# EAGLE design Versino1 (EAGLE 9.6.2)

## Sheet 1 of 2
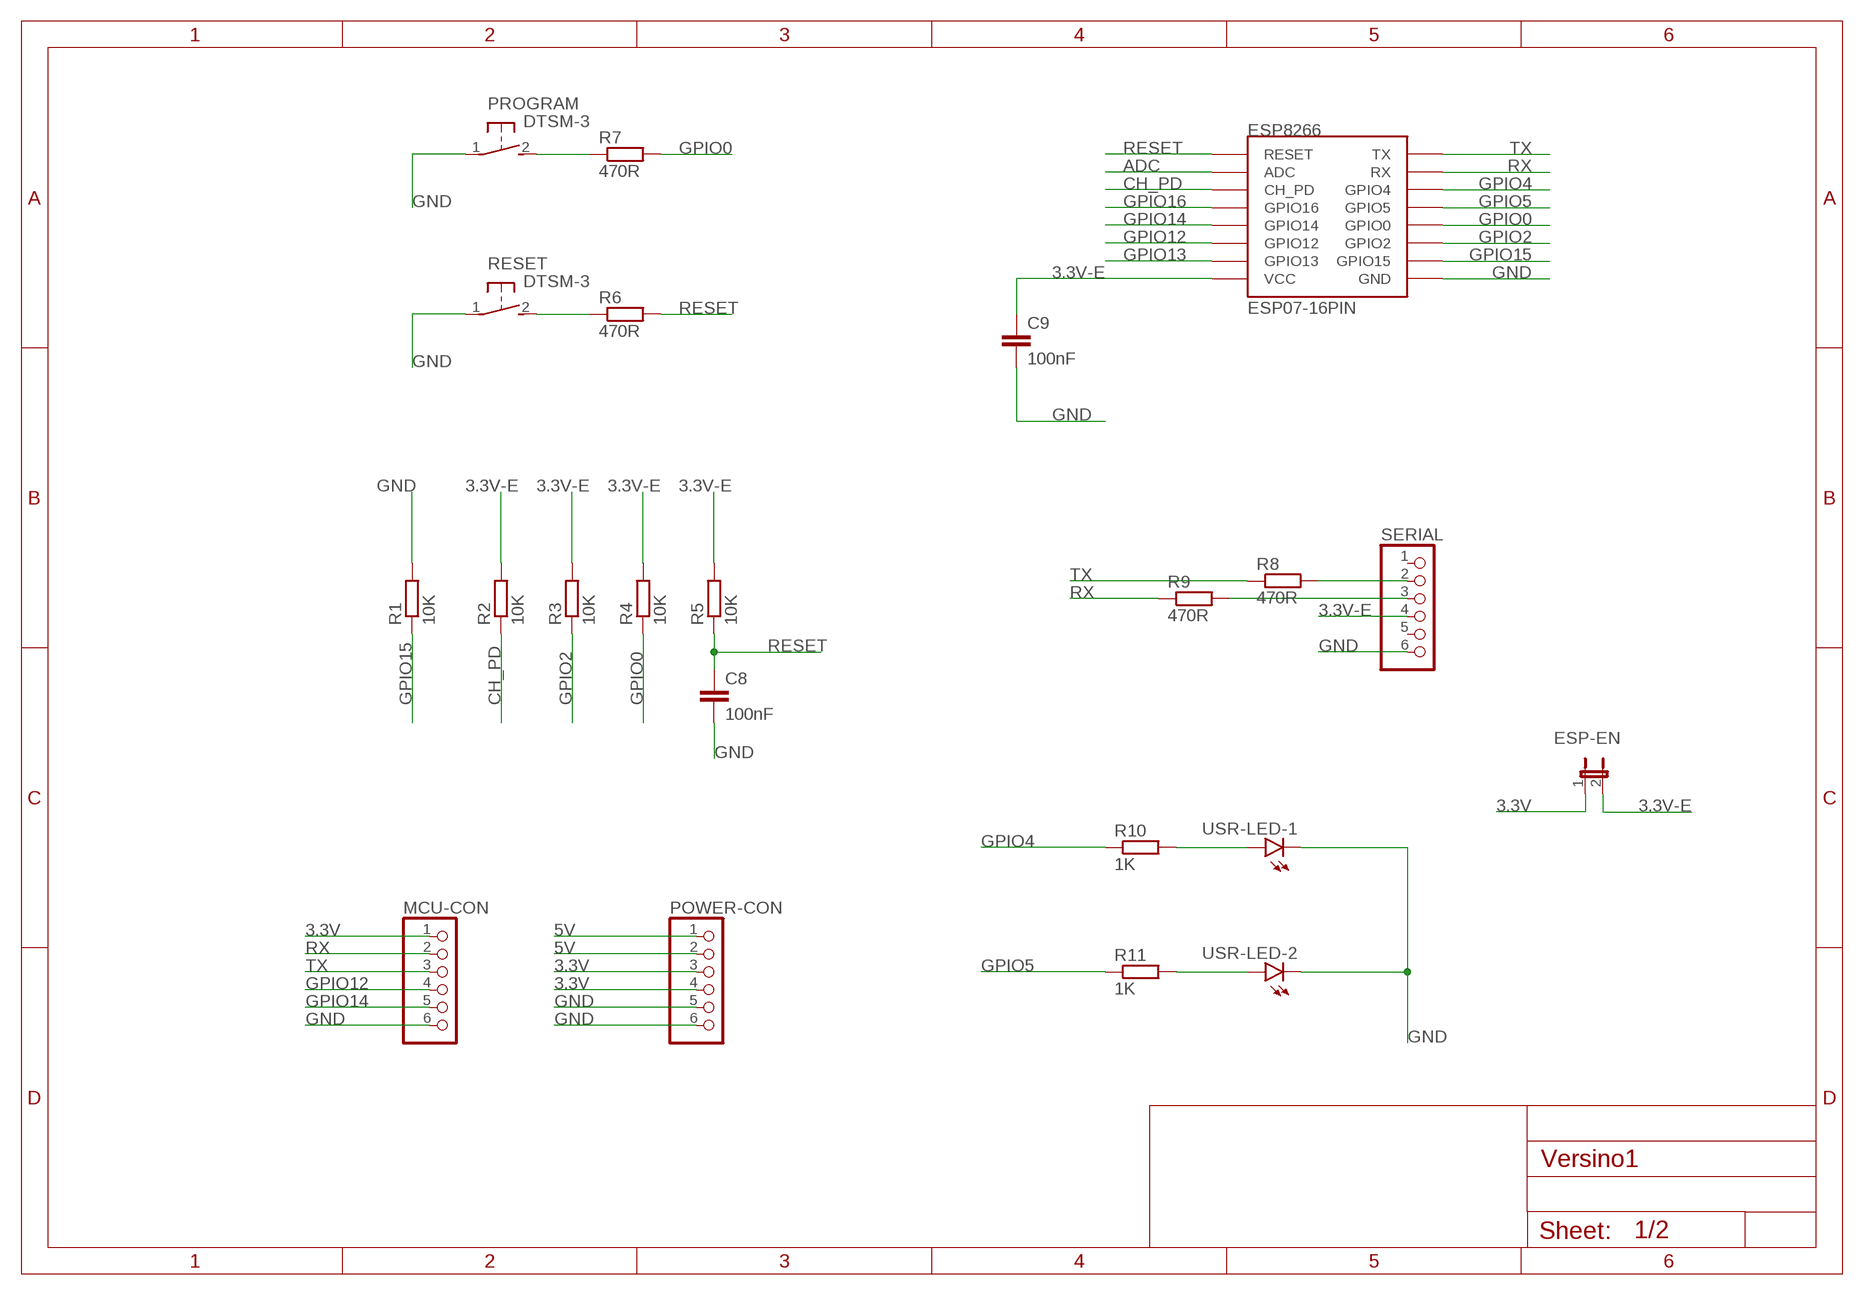
[diagram p0: schematic, sheet 1]

### Parts
C8  100nF  C-EUC0603  [C0603]
C9  100nF  C-EUC0603  [C0603]
ESP8266  ESP07-16PIN  [ESP07-16PIN]
ESP-EN  JP1E  [JP1]
MCU-CON  PINHD-1X6  [1X06]
POWER-CON  PINHD-1X6  [1X06]
PROGRAM  DTSM-3  [DTSM-3]
R1  10K  R-EU_R0603  [R0603]
R2  10K  R-EU_R0603  [R0603]
R3  10K  R-EU_R0603  [R0603]
R4  10K  R-EU_R0603  [R0603]
R5  10K  R-EU_R0603  [R0603]
R6  470R  R-EU_R0603  [R0603]
R7  470R  R-EU_R0603  [R0603]
R8  470R  R-EU_R0603  [R0603]
R9  470R  R-EU_R0603  [R0603]
R10  1K  R-EU_R0603  [R0603]
R11  1K  R-EU_R0603  [R0603]
RESET  DTSM-3  [DTSM-3]
SERIAL  PINHD-1X6  [1X06]
USR-LED-1  LEDCHIP-LED0805  [CHIP-LED0805]
USR-LED-2  LEDCHIP-LED0805  [CHIP-LED0805]

### Nets
3.3V: ESP-EN.1 MCU-CON.1 POWER-CON.3 POWER-CON.4 ; also sheet 2
3.3V-E: C9.1 ESP8266.VCC ESP-EN.2 R2.2 R3.2 R4.2 R5.2 SERIAL.4
5V: POWER-CON.1 POWER-CON.2 ; also sheet 2
ADC: ESP8266.ADC
CH_PD: ESP8266.CH_PD R2.1
GND: C8.2 C9.2 ESP8266.GND MCU-CON.6 POWER-CON.5 POWER-CON.6 PROGRAM.1 R1.2 RESET.1 SERIAL.6 USR-LED-1.C USR-LED-2.C ; also sheet 2
GPIO0: ESP8266.GPIO0 R4.1 R7.2
GPIO2: ESP8266.GPIO2 R3.1
GPIO4: ESP8266.GPIO4 R10.1
GPIO5: ESP8266.GPIO5 R11.1
GPIO12: ESP8266.GPIO12 MCU-CON.4
GPIO13: ESP8266.GPIO13
GPIO14: ESP8266.GPIO14 MCU-CON.5
GPIO15: ESP8266.GPIO15 R1.1
GPIO16: ESP8266.GPIO16
N$1: PROGRAM.2 R7.1
N$2: R6.1 RESET.2
N$3: R8.2 SERIAL.2
N$4: R9.2 SERIAL.3
N$28: R11.2 USR-LED-2.A
N$29: R10.2 USR-LED-1.A
RESET: C8.1 ESP8266.REST(RESET) R5.1 R6.2
RX: ESP8266.RX MCU-CON.2 R9.1
TX: ESP8266.TX MCU-CON.3 R8.1
Unconnected: SERIAL.1 SERIAL.5

## Sheet 2 of 2
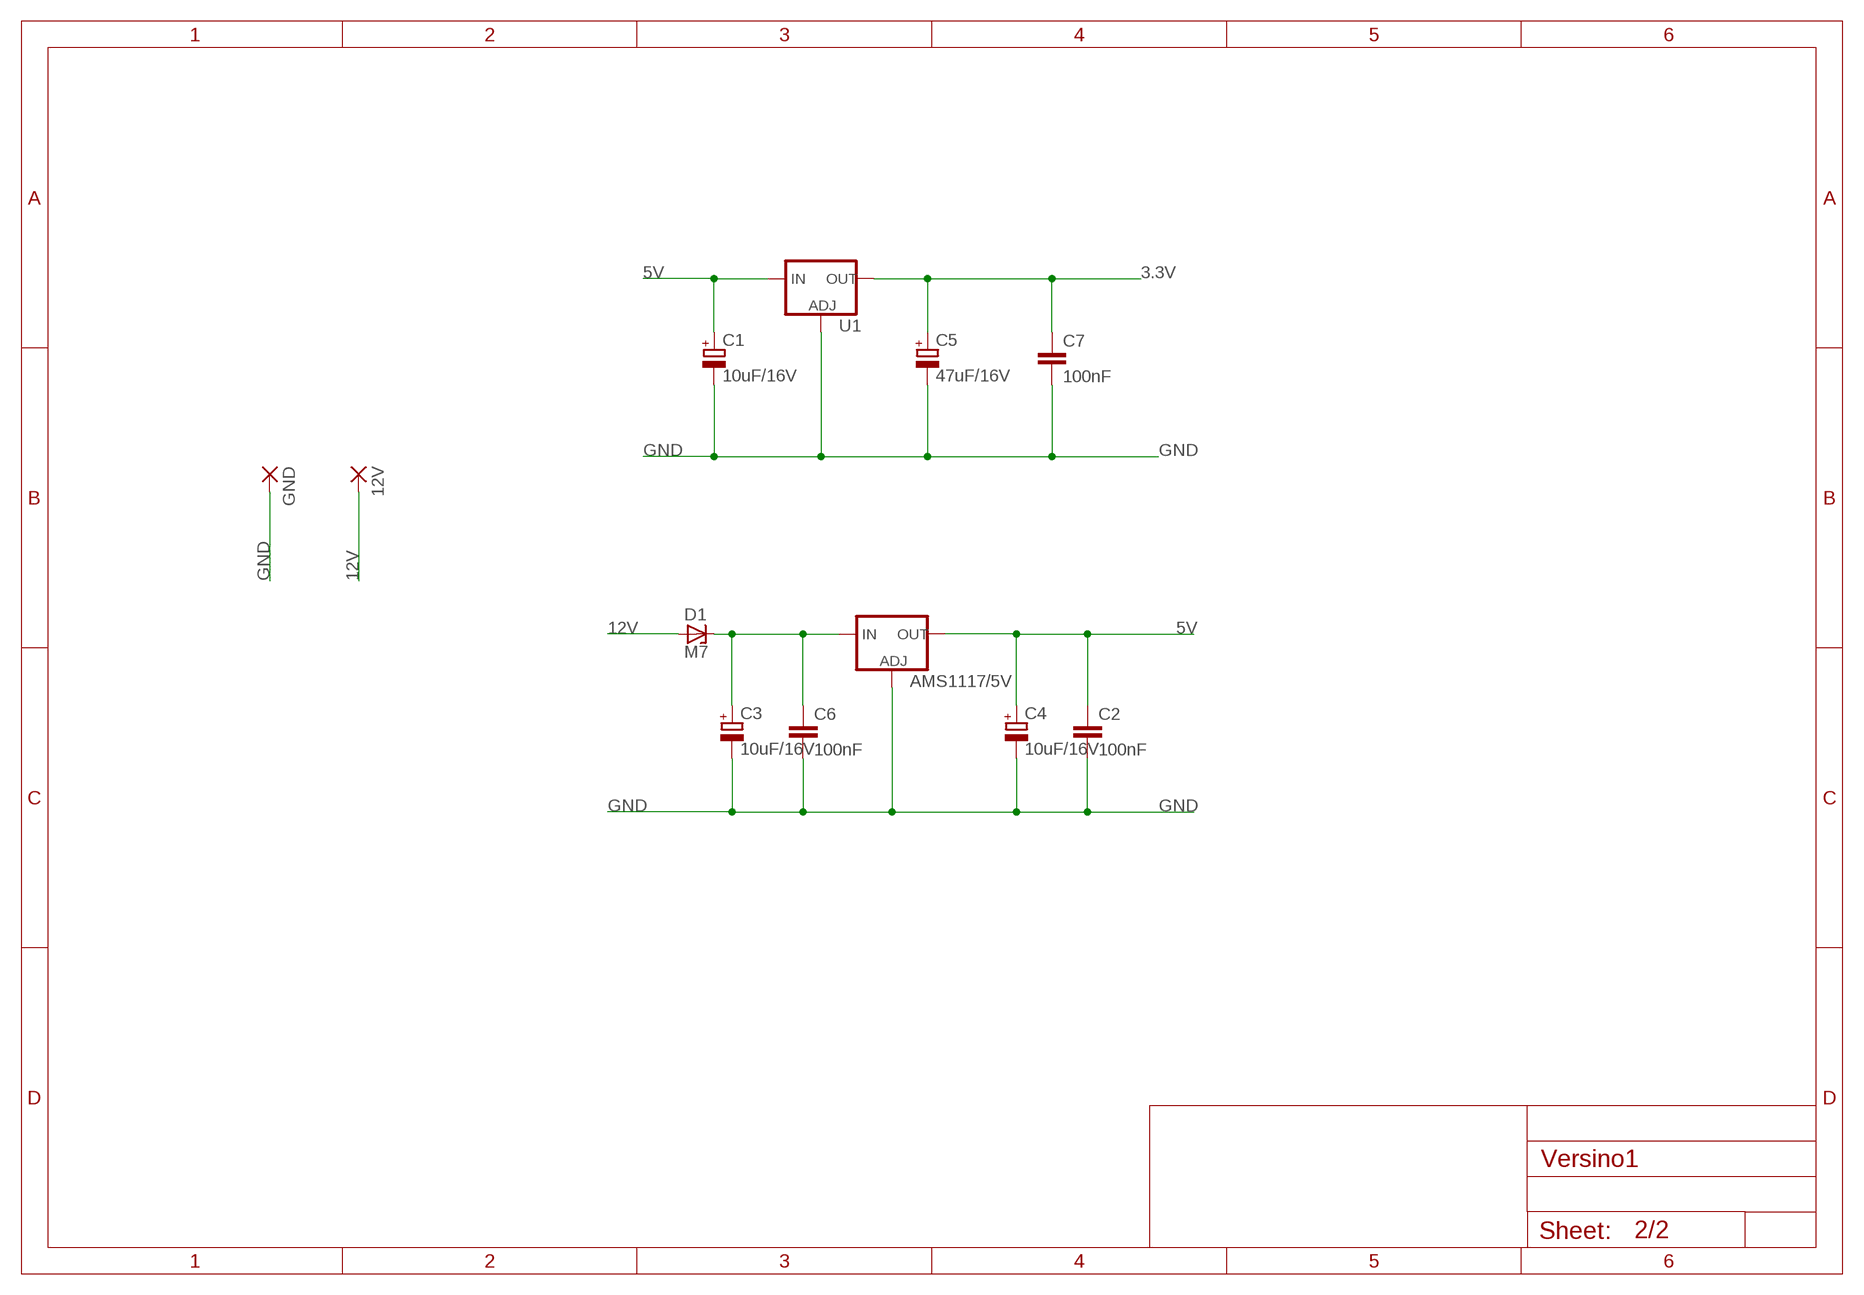
[diagram p1: schematic, sheet 2]

### Parts
12V  SMD5  [SMD2,54-5,08]
AMS1117/5V  V_REG_LM1117SOT223  [SOT223]
C1  10uF/16V  CPOL-EUSMCB  [SMC_B]
C2  100nF  C-EUC0603  [C0603]
C3  10uF/16V  CPOL-EUSMCB  [SMC_B]
C4  10uF/16V  CPOL-EUSMCB  [SMC_B]
C5  47uF/16V  CPOL-EUSMCB  [SMC_B]
C6  100nF  C-EUC0603  [C0603]
C7  100nF  C-EUC0603  [C0603]
D1  M7  1SMA5913BT3G  [DO214AC]
GND  SMD5  [SMD2,54-5,08]
U1  V_REG_LM1117SOT223  [SOT223]

### Nets
3.3V: C5.+ C7.1 U1.2(OUT) U1.4(OUT) ; also sheet 1
5V: AMS1117/5V.2(OUT) AMS1117/5V.4(OUT) C1.+ C2.1 C4.+ U1.3(IN) ; also sheet 1
12V: 12V.1(P) D1.A
GND: AMS1117/5V.1(ADJ) C1.- C2.2 C3.- C4.- C5.- C6.2 C7.2 GND.1(P) U1.1(ADJ) ; also sheet 1
N$5: AMS1117/5V.3(IN) C3.+ C6.1 D1.C

## Library data of the parts
12V GND = wirepad:SMD5: SMD PAD
AMS1117/5V U1 = SparkFun-IC-Power:V_REG_LM1117: Voltage Regulator LM1117 Standard adjustable voltage regulator but in SMD form. Spark Fun Electronics SKU : COM-00595; PROD_ID: VREG-08170
C1 C3-C5 = rcl:CPOL-EU: POLARIZED CAPACITOR, European symbol; SPICEPREFIX: C
C2 C6-C9 = rcl:C-EU: CAPACITOR, European symbol; SPICEPREFIX: C
D1 = 1sma59xx_10:1SMA59*BT3G: 1SMA59xxBT3G Series 1.5 Watt Plastic Surface Mount Zener Voltage Regulators Source: http://www.onsemi.com/pub_link/Collateral/1SMA5913BT3-D.PDF; MF: ON Semiconductor; MPN: 1SMA5913BT3G; OC_FARNELL: 1431138; OC_NEWARK: 26K5252
ESP8266 = esp8266modules:ESP07-16PIN: ESP8266 Wifi module 07 - 16 pins; DIMENSIONS: 22.0 x 16.0 mm; PINS: 16; PITCH: 0.078" / 2 mm
ESP-EN = jumper:JP1E: JUMPER
MCU-CON POWER-CON SERIAL = pinhead:PINHD-1X6: PIN HEADER
PROGRAM RESET = switch-tact:DTSM-3
R1-R11 = rcl:R-EU_: RESISTOR, European symbol; SPICEPREFIX: R
USR-LED-1 USR-LED-2 = led:LED: LED OSRAM: - CHIPLED LG R971, LG N971, LY N971, LG Q971, LY Q971, LO R971, LY R971 LH N974, LH R974 LS Q976, LO Q976, LY Q976 LO Q996 - Hyper CHIPLED LW Q18S LB Q993, LB Q99A, LB R99A - SideLED LS A670, LO A670, LY A670, LG A670, LP A670 LB A673, LV A673, LT A673, LW A673 LH A674 LY A675 LS A676, LA A676, LO A676, LY A676, LW A676 LS A679, LY A679, LG A679 - Hyper Micro SIDELED® LS Y876, LA Y876, LO Y876, LY Y876 LT Y87S - SmartLED LW L88C, LW L88S LB L89C, LB L89S, LG L890 LS L89K, LO L89K, LY L89K LS L896, LA L896, LO L896, LY L896 - TOPLED LS T670, LO T670, LY T670, LG T670, LP T670 LSG T670, LSP T670, LSY T670, LOP T670, LYG T670 LG T671, LOG T671, LSG T671 LB T673, LV T673, LT T673, LW T673 LH T674 LS T676, LA T676, LO T676, LY T676, LB T676, LH T676, LSB T676, LW T676 LB T67C, LV T67C, LT T67C, LS T67K, LO T67K, LY T67K, LW E67C LS E67B, LA E67B, LO E67B, LY E67B, LB E67C, LV E67C, LT E67C LW T67C LS T679, LY T679, LG T679 LS T770, LO T770, LY T770, LG T770, LP T770 LB T773, LV T773, LT T773, LW T773 LH T774 LS E675, LA E675, LY E675, LS T675 LS T776, LA T776, LO T776, LY T776, LB T776 LHGB T686 LT T68C, LB T68C - Hyper Mini TOPLED® LB M676 - Mini TOPLED Santana® LG M470 LS M47K, LO M47K, LY M47K Source: http://www.osram.convergy.de LUXEON: - LUMILED® LXK2-PW12-R00, LXK2-PW12-S00, LXK2-PW14-U00, LXK2-PW14-V00 LXK2-PM12-R00, LXK2-PM12-S00, LXK2-PM14-U00 LXK2-PE12-Q00, LXK2-PE12-R00, LXK2-PE12-S00, LXK2-PE14-T00, LXK2-PE14-U00 LXK2-PB12-K00, LXK2-PB12-L00, LXK2-PB12-M00, LXK2-PB14-N00, LXK2-PB14-P00, LXK2-PB14-Q00 LXK2-PR12-L00, LXK2-PR12-M00, LXK2-PR14-Q00, LXK2-PR14-R00 LXK2-PD12-Q00, LXK2-PD12-R00, LXK2-PD12-S00 LXK2-PH12-R00, LXK2-PH12-S00 LXK2-PL12-P00, LXK2-PL12-Q00, LXK2-PL12-R00 Source: www.luxeon.com KINGBRIGHT: KA-3528ASYC Source: www.kingbright.com

## Board
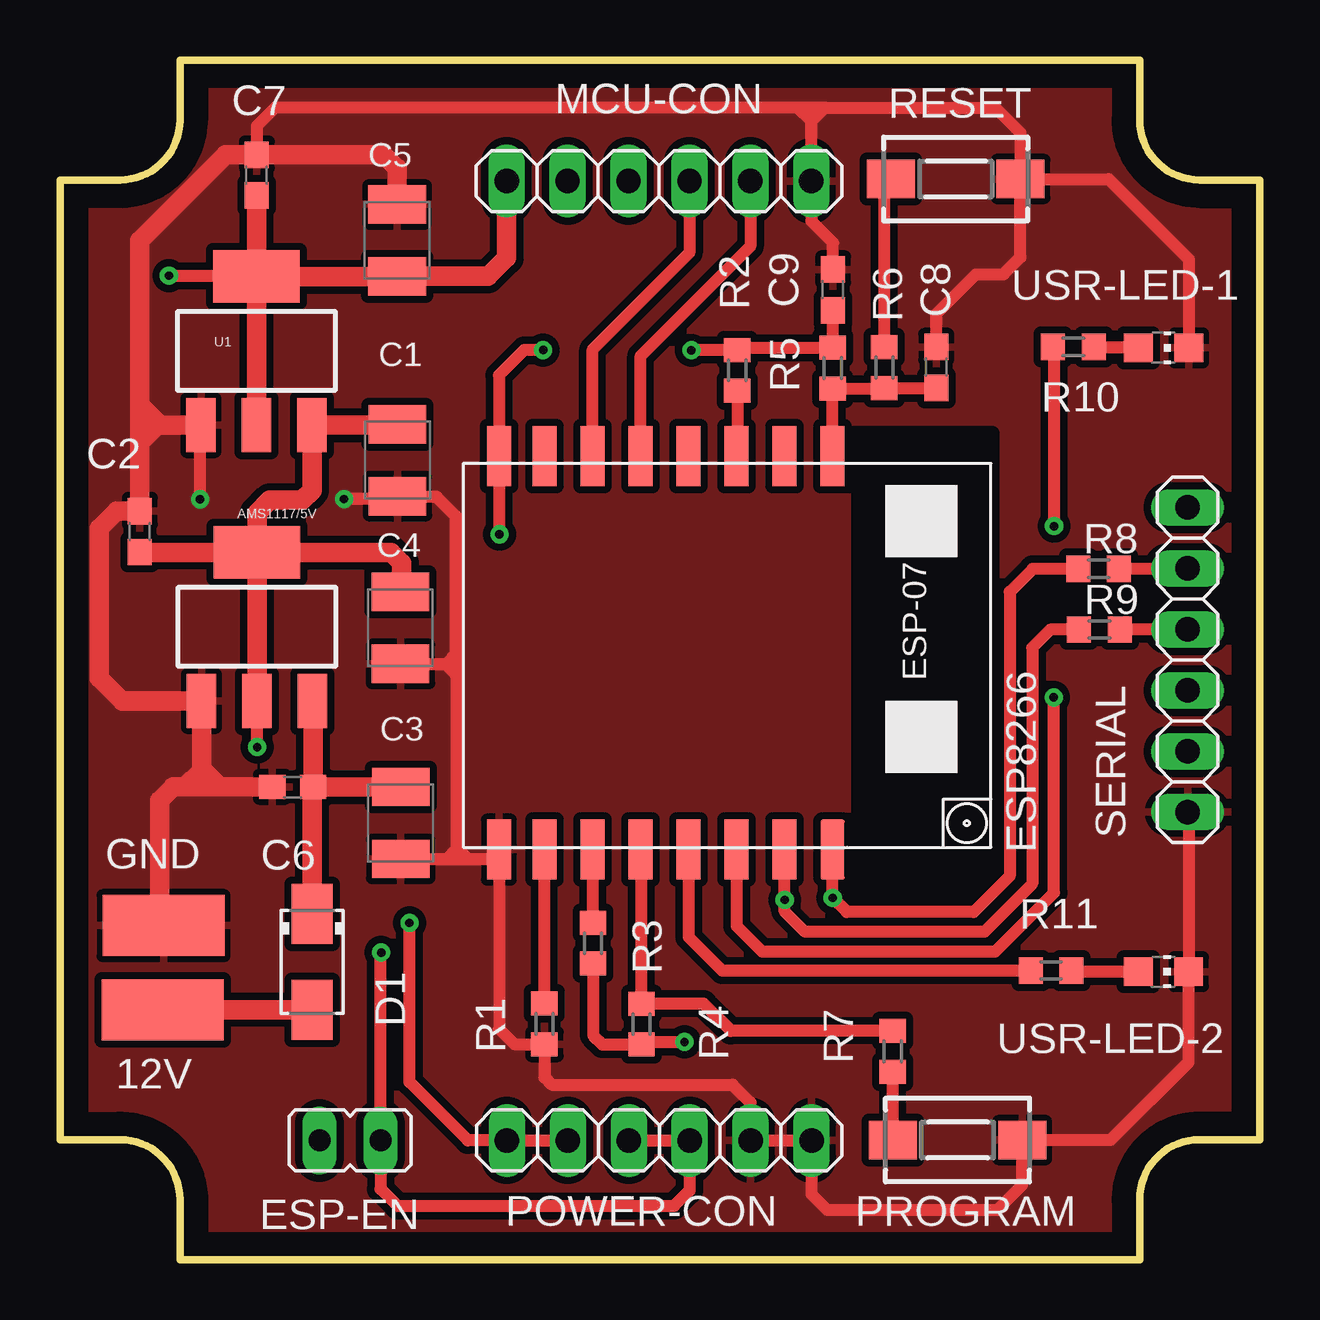
[diagram p2: board, top side]
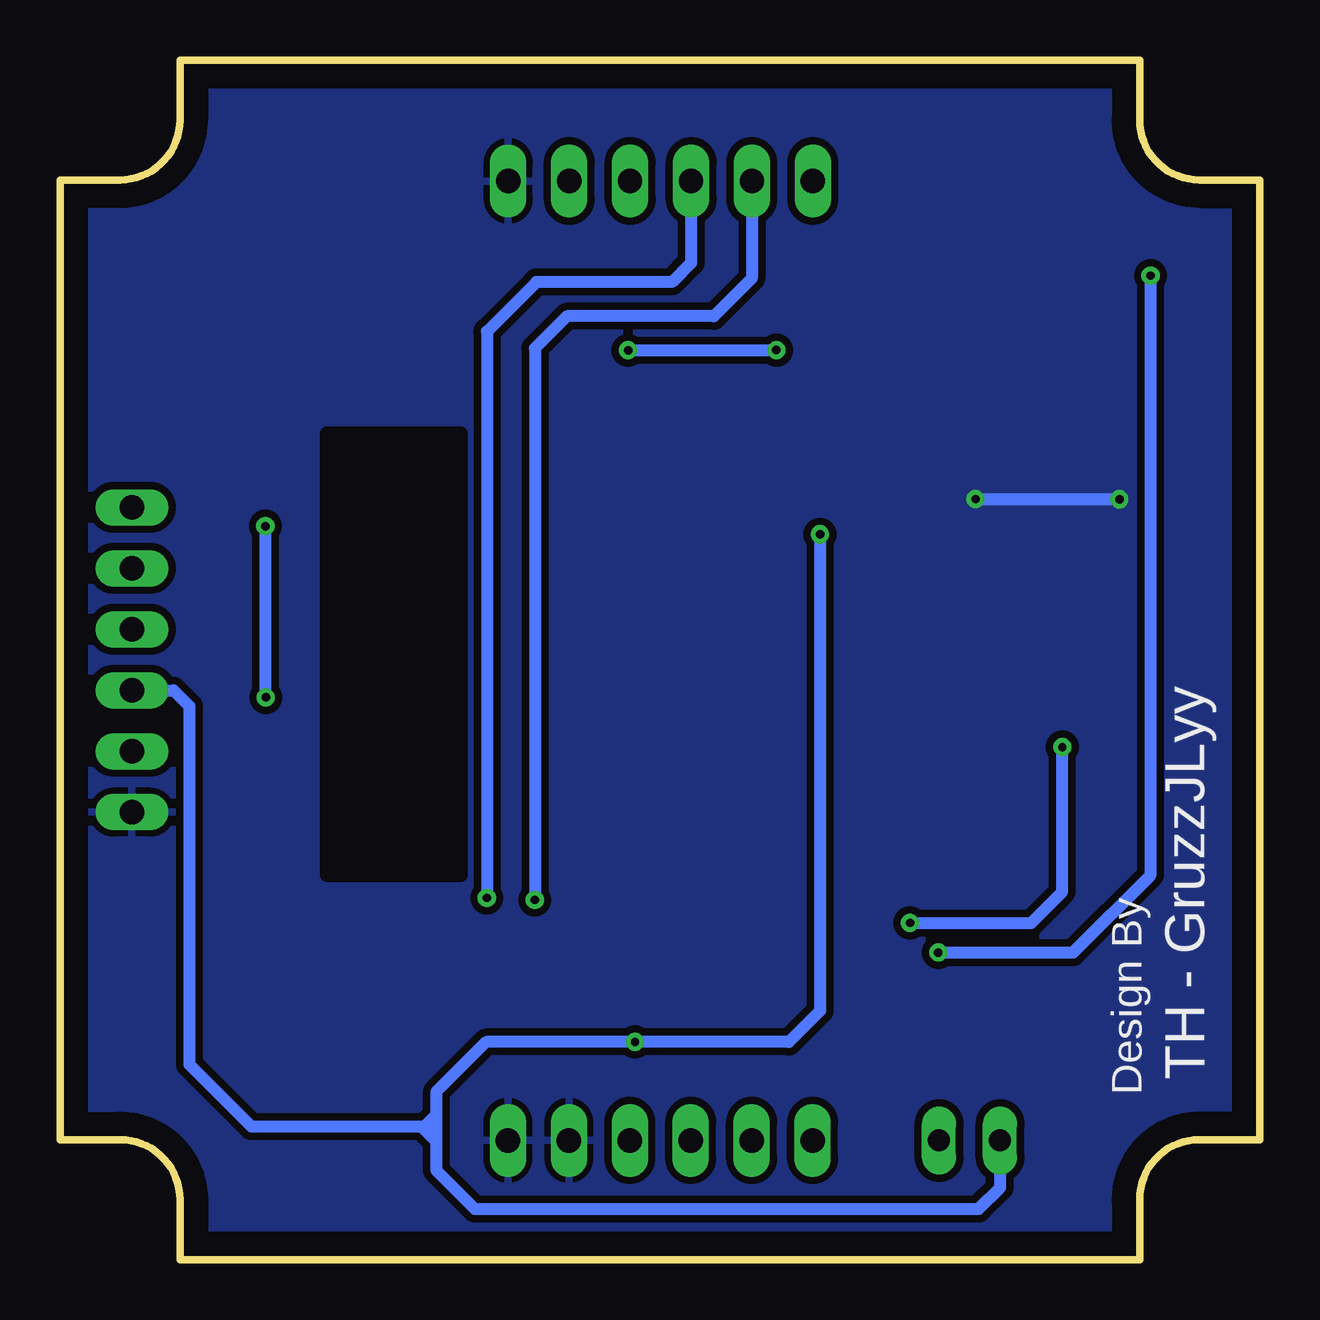
[diagram p3: board, bottom side, seen from below]

Size 50 x 50 mm. Coordinates in mm from the lower left corner, seen from the top.
Outline: 0,45 0,5 2.5,5 arc-90 5,2.5 5,0 45,0 45,2.5 arc-90 47.5,5 50,5 50,45 47.5,45 arc-90 45,47.5 45,50 5,50 5,47.5 arc-90 2.5,45 0,45
Copper layers (1*16): Top 0.035mm / dielectric 1.5mm / Bottom 0.035mm
Design rules "default": minimum track width 6mil, minimum drill 0.35mm, track to track 6mil, track to pad 6mil, pad to pad 6mil, via to via 6mil, smd to smd 6mil, copper to edge 40mil, drill to drill 6mil, minimum pad ring 10mil, minimum via ring 8mil, stop-mask expansion 4mil, vias tented up to drill 0mil, thermal gap 10mil
tRestrict: area 33.3,16 to 38.9,34.5
bRestrict: area 33.3,16 to 38.9,34.4

### Footprints (pad centres in the part's own frame; a part is rotated, then mirrored left to right if it is on the bottom)
SMD2,54-5,08 = smd 2.54 x 5.08: 1 0,0
SOT223 = smd 1.219 x 2.235: 1 -2.311,-3.099; 2 0,-3.099; 3 2.311,-3.099 | smd 3.6 x 2.2: 4 0,3.099
SMC_B = smd 1.6 x 2.4: + -1.5,0; - 1.5,0
C0603 = smd 1.1 x 1: 1 -0.85,0; 2 0.85,0
DO214AC = smd 2.5 x 1.7: A 2,0; C -2,0
ESP07-16PIN = smd 2.5 x 1: ADC -8.2,3.8; CH_PD -8.2,1.8; GND 8.2,-8.105; GPIO0 8.2,-2.2; GPIO2 8.2,-4.2; GPIO4 8.2,1.8; GPIO5 8.2,-0.2; GPIO12 -8.2,-4.2; GPIO13 -8.2,-6.2; GPIO14 -8.2,-2.2; GPIO15 8.2,-6.2; GPIO16 -8.2,-0.2; REST -8.2,5.8; RX 8.2,3.8; TX 8.2,5.8; VCC -8.2,-8.105
JP1 = drill 0.914 long: 1 0,-1.27; 2 0,1.27
1X06 = drill 1.016 long: 1 -6.35,0; 2 -3.81,0; 3 -1.27,0; 4 1.27,0; 5 3.81,0; 6 6.35,0
DTSM-3 = smd 2 x 1.6: 1 -2.7,0; 2 2.7,0
R0603 = smd 1 x 1.1: 1 -0.85,0; 2 0.85,0
CHIP-LED0805 = smd 1.2 x 1.2: A 0,-1.05; C 0,1.05

### Placement (x,y rotation side)
12V  4.28,10.4 270 top
AMS1117/5V  8.21,26.38 0 top
C1  14.07,33.32 270 top
C2  3.33,30.34 90 top
C3  14.2,18.2 270 top
C4  14.19,26.33 270 top
C5  14.05,42.48 90 top
C6  9.7,19.7 180 top
C7  8.2,45.2 90 top
C8  36.53,37.19 90 top
C9  32.22,40.42 90 top
D1  10.51,12.41 270 top
ESP8266  26.41,25.29 270 top
ESP-EN  12.09,4.96 90 top
GND  4.32,13.92 90 top
MCU-CON  24.97,44.96 0 top
POWER-CON  24.98,4.96 0 top
PROGRAM  37.41,4.98 180 top
R1  20.19,9.82 270 top
R2  28.23,37.06 90 top
R3  22.22,13.19 270 top
R4  24.24,9.81 270 top
R5  32.21,37.16 90 top
R6  34.36,37.18 270 top
R7  34.71,8.68 90 top
R8  43.29,28.79 0 top
R9  43.32,26.26 0 top
R10  42.24,38.04 0 top
R11  41.31,12.05 0 top
RESET  37.34,45.04 180 top
SERIAL  47,25 270 top
U1  8.19,37.88 0 top
USR-LED-1  46,38 270 top
USR-LED-2  46,12 270 top

### Tracks (layer width: path | path; a pad name or v marks a point on that pad's centre or on a via)
3.3V  (via drill 0.35)
  Top 0.508: 13.36,4.93 13.36,2.94 14.07,2.23 25.6,2.23 26.25,2.88 26.25,4.78 | 23.73,4.96 POWER-CON.4 | ESP-EN.1 13.36,12.77 v13.39,12.8 | v4.54,41.01 8.16,41.01 U1.4
  Top 0.813: U1.2 U1.4 | U1.4 C7.1 | U1.4 C5.+ 17.84,40.98 18.62,41.76 18.62,44.91
  Top 1.27: MCU-CON.1 18.62,44.91 | POWER-CON.4 26.25,4.78 | POWER-CON.3 23.73,4.96 | ESP-EN.1 13.36,4.93
  Bottom 0.508: v13.39,12.8 7.78,12.8 4.54,16.04 v4.54,41.01
3.3V-E  (via drill 0.35)
  Top 0.508: R3.2 22.22,9.35 22.61,8.96 R4.2 24.35,9.07 v26.03,9.07 | C9.1 R5.2 28.33,38.01 R2.2 v26.32,37.9 | v20.14,37.91 19.35,37.91 18.3,36.86 ESP8266.VCC 18.3,30.25 v18.32,30.23
  Bottom 0.508: v26.32,37.9 v20.15,37.9 v20.14,37.91 | 34.32,6.04 34.32,6.98 32.23,9.07 v26.03,9.07 19.62,9.07 18.32,10.37 v18.32,30.23 | 34.32,6.04 34.32,5.55 | 34.32,5.55 34.32,4.93 | 34.32,4.93 34.32,3.72 32.71,2.11 11.71,2.11 10.82,3 10.82,4.89 | 34.32,5.55 34.81,5.55 | 34.94,5.55 42.03,5.55 44.6,8.12 44.6,23.06 45.27,23.73 SERIAL.4 | 34.94,5.55 34.81,5.55 | 34.81,5.55 34.32,6.04 | 34.94,5.55 34.32,4.93
  Bottom 1.27: ESP-EN.2 10.82,4.89 | SERIAL.4
5V  (via drill 0.35)
  Top 0.508: 18.67,4.96 21.13,4.96 | POWER-CON.1 17.01,4.96 14.57,7.4 v14.57,14.03 | v8.22,21.36 v8.21,21.37 AMS1117/5V.2
  Top 0.813: AMS1117/5V.2 AMS1117/5V.4 | AMS1117/5V.4 3.34,29.48 C2.1 | AMS1117/5V.4 8.21,31.12 8.74,31.65 10.1,31.65 10.5,32.05 U1.3 14.03,34.78 C1.+ | AMS1117/5V.4 13.8,29.48 14.24,29.04 14.24,27.88 C4.+
  Top 1.27: POWER-CON.2 21.13,4.96 | POWER-CON.1 18.67,4.96
  Bottom 0.508: v14.57,14.03 9.52,14.03 8.22,15.33 v8.22,21.36
12V
  Top 0.813: D1.A 12V.1
CH_PD
  Top 0.508: R2.1 28.23,33.51 ESP8266.CH_PD
GND  (via drill 0.35)
  Top 0.508: 28.79,5.01 28.79,6.54 28.04,7.29 20.49,7.29 20.19,7.59 R1.2 18.94,8.97 18.3,9.61 ESP8266.GND 17.91,16.7 17,16.7 | POWER-CON.5 POWER-CON.6 | 31.33,4.92 31.33,2.71 31.97,2.07 39.07,2.07 40.11,3.11 PROGRAM.1 43.79,4.98 47.05,8.24 USR-LED-2.C 47.05,18.6 | C9.2 32.22,42.38 31.32,43.28 31.32,44.89 | MCU-CON.6 31.32,47.45 | 31.32,47.45 31.89,48.02 | 31.89,48.02 38.98,48.02 40.04,46.96 RESET.1 | RESET.1 43.71,45.04 47.05,41.7 USR-LED-1.C | C8.2 36.53,39.42 38.18,41.07 39.33,41.07 40.04,41.78 RESET.1 | 31.89,48.02 30.75,48.02 | 30.75,48.02 8.97,48.02 8.2,47.25 C7.2 | 31.32,47.45 30.75,48.02 | C4.- 16.11,24.83 | 16.11,24.83 16.52,24.83 | 14.1,31.79 15.7,31.79 16.52,30.97 16.52,25.24 | 16.52,24.83 16.52,25.24 | C3.- 16.13,16.7 | 16.13,16.7 16.68,16.7 | 16.68,16.7 17,16.7 | 16.68,16.7 16.52,16.86 16.52,17.09 | 16.52,24.39 16.52,17.18 | 16.52,24.83 16.52,24.39 | 16.52,24.39 16.11,24.8 16.11,24.83 | 16.52,17.18 16.52,17.09 | 16.52,17.09 16.13,16.7 | 16.52,17.18 17,16.7 | C1.- 13.95,31.7 v11.84,31.7 | v5.84,31.69 5.84,34.74 U1.1 | 16.11,24.83 16.52,25.24
  Top 0.813: C6.2 6.67,19.7 | 6.67,19.7 5.87,19.7 | 5.87,19.7 5.23,19.7 | 5.23,19.7 4.71,19.7 4.15,19.14 4.15,14.09 GND.1 | 5.9,20.37 AMS1117/5V.1 2.6,23.28 1.65,24.23 1.65,30.46 2.38,31.19 C2.2 3.33,34.03 | 5.9,20.37 5.9,19.73 5.87,19.7 | 5.9,20.37 5.23,19.7 | 5.9,20.37 6,20.37 6.67,19.7 | 4.08,34.78 U1.1 | 3.33,34.03 4.08,34.78 | C5.- 14.05,45.49 13.49,46.05 C7.2 6.91,46.05 3.33,42.47 3.33,35.63 | 3.33,35.63 3.33,34.03 | 4.08,34.78 4.08,34.88 3.33,35.63 | 14.1,31.79 C1.-
  Top 1.27: MCU-CON.6 31.32,44.89 | SERIAL.6 47.05,18.6 | POWER-CON.6 31.33,4.92 | POWER-CON.5 28.79,5.01
  Bottom 0.508: v11.84,31.7 v5.85,31.7 v5.84,31.69
  pour Top (isolate 0.305): -8,55 -8,-5 2,-5 56,-5 56,3 56,55
  pour Bottom (isolate 0.305): -12,57 -12,-9 -4,-9 60,-9 60,-3 60,57
GPIO0
  Top 0.508: ESP8266.GPIO0 24.24,17.05 R4.1 26.83,10.66 27.96,9.53 R7.2
GPIO2
  Top 0.508: R3.1 22.22,17.07 ESP8266.GPIO2
GPIO4  (via drill 0.35)
  Top 0.508: ESP8266.GPIO4 28.21,13.9 29.27,12.84 38.98,12.84 41.43,15.29 v41.43,23.42 v41.42,23.43 | v41.44,30.57 41.44,37.99 R10.1
  Bottom 0.508: v41.42,23.43 41.42,30.55 v41.44,30.57
GPIO5
  Top 0.508: ESP8266.GPIO5 26.21,13.44 27.6,12.05 R11.1
GPIO12
  Top 0.508: ESP8266.GPIO12 22.21,37.94 26.24,41.97 26.24,44.93
  Top 1.27: MCU-CON.4 26.24,44.93
GPIO14
  Top 0.508: ESP8266.GPIO14 24.21,37.67 28.78,42.24 28.78,44.83
  Top 1.27: MCU-CON.5 28.78,44.83
GPIO15
  Top 0.508: R1.1 20.19,17.07 ESP8266.GPIO15
N$1
  Top 0.508: PROGRAM.2 R7.1
N$2
  Top 0.508: R6.1 34.36,44.76 RESET.2
N$3
  Top 0.508: 46.98,28.79 R8.2
  Top 1.27: SERIAL.2 46.98,28.79
N$4
  Top 0.508: 46.9,26.26 R9.2
  Top 1.27: SERIAL.3 46.9,26.26
N$5
  Top 0.813: D1.C 10.51,19.66 C6.1 | C6.1 C3.+ | C6.1 10.55,23.25 AMS1117/5V.3
N$28
  Top 0.508: R11.2 42.21,12 USR-LED-2.A
N$29
  Top 0.508: USR-LED-1.A 43.13,38 R10.2
RESET
  Top 0.508: ESP8266.REST R5.1 34.34,36.31 R6.2 C8.1
RX  (via drill 0.35)
  Top 0.508: R9.1 41.28,26.26 40.53,25.51 40.53,15.66 38.53,13.66 31.06,13.66 30.21,14.51 v30.21,14.99 ESP8266.RX
  Bottom 0.508: 21.16,44.88 21.16,40.9 22.74,39.32 28.87,39.32 30.21,37.98 v30.21,14.99
  Bottom 1.27: MCU-CON.2 21.16,44.88
TX  (via drill 0.35)
  Top 0.508: R8.1 40.55,28.79 39.59,27.83 39.59,15.98 38.09,14.48 32.8,14.48 v32.21,15.07 ESP8266.TX
  Bottom 0.508: 23.7,44.79 23.7,41.54 24.49,40.75 30.14,40.75 32.21,38.68 v32.21,15.07
  Bottom 1.27: MCU-CON.3 23.7,44.79

### Text on the board
bPlace: TH - GruzzJLyy | Design By